# EAGLE schematic BMS_Master (EAGLE 7.2.0)

## Sheet 1 of 5
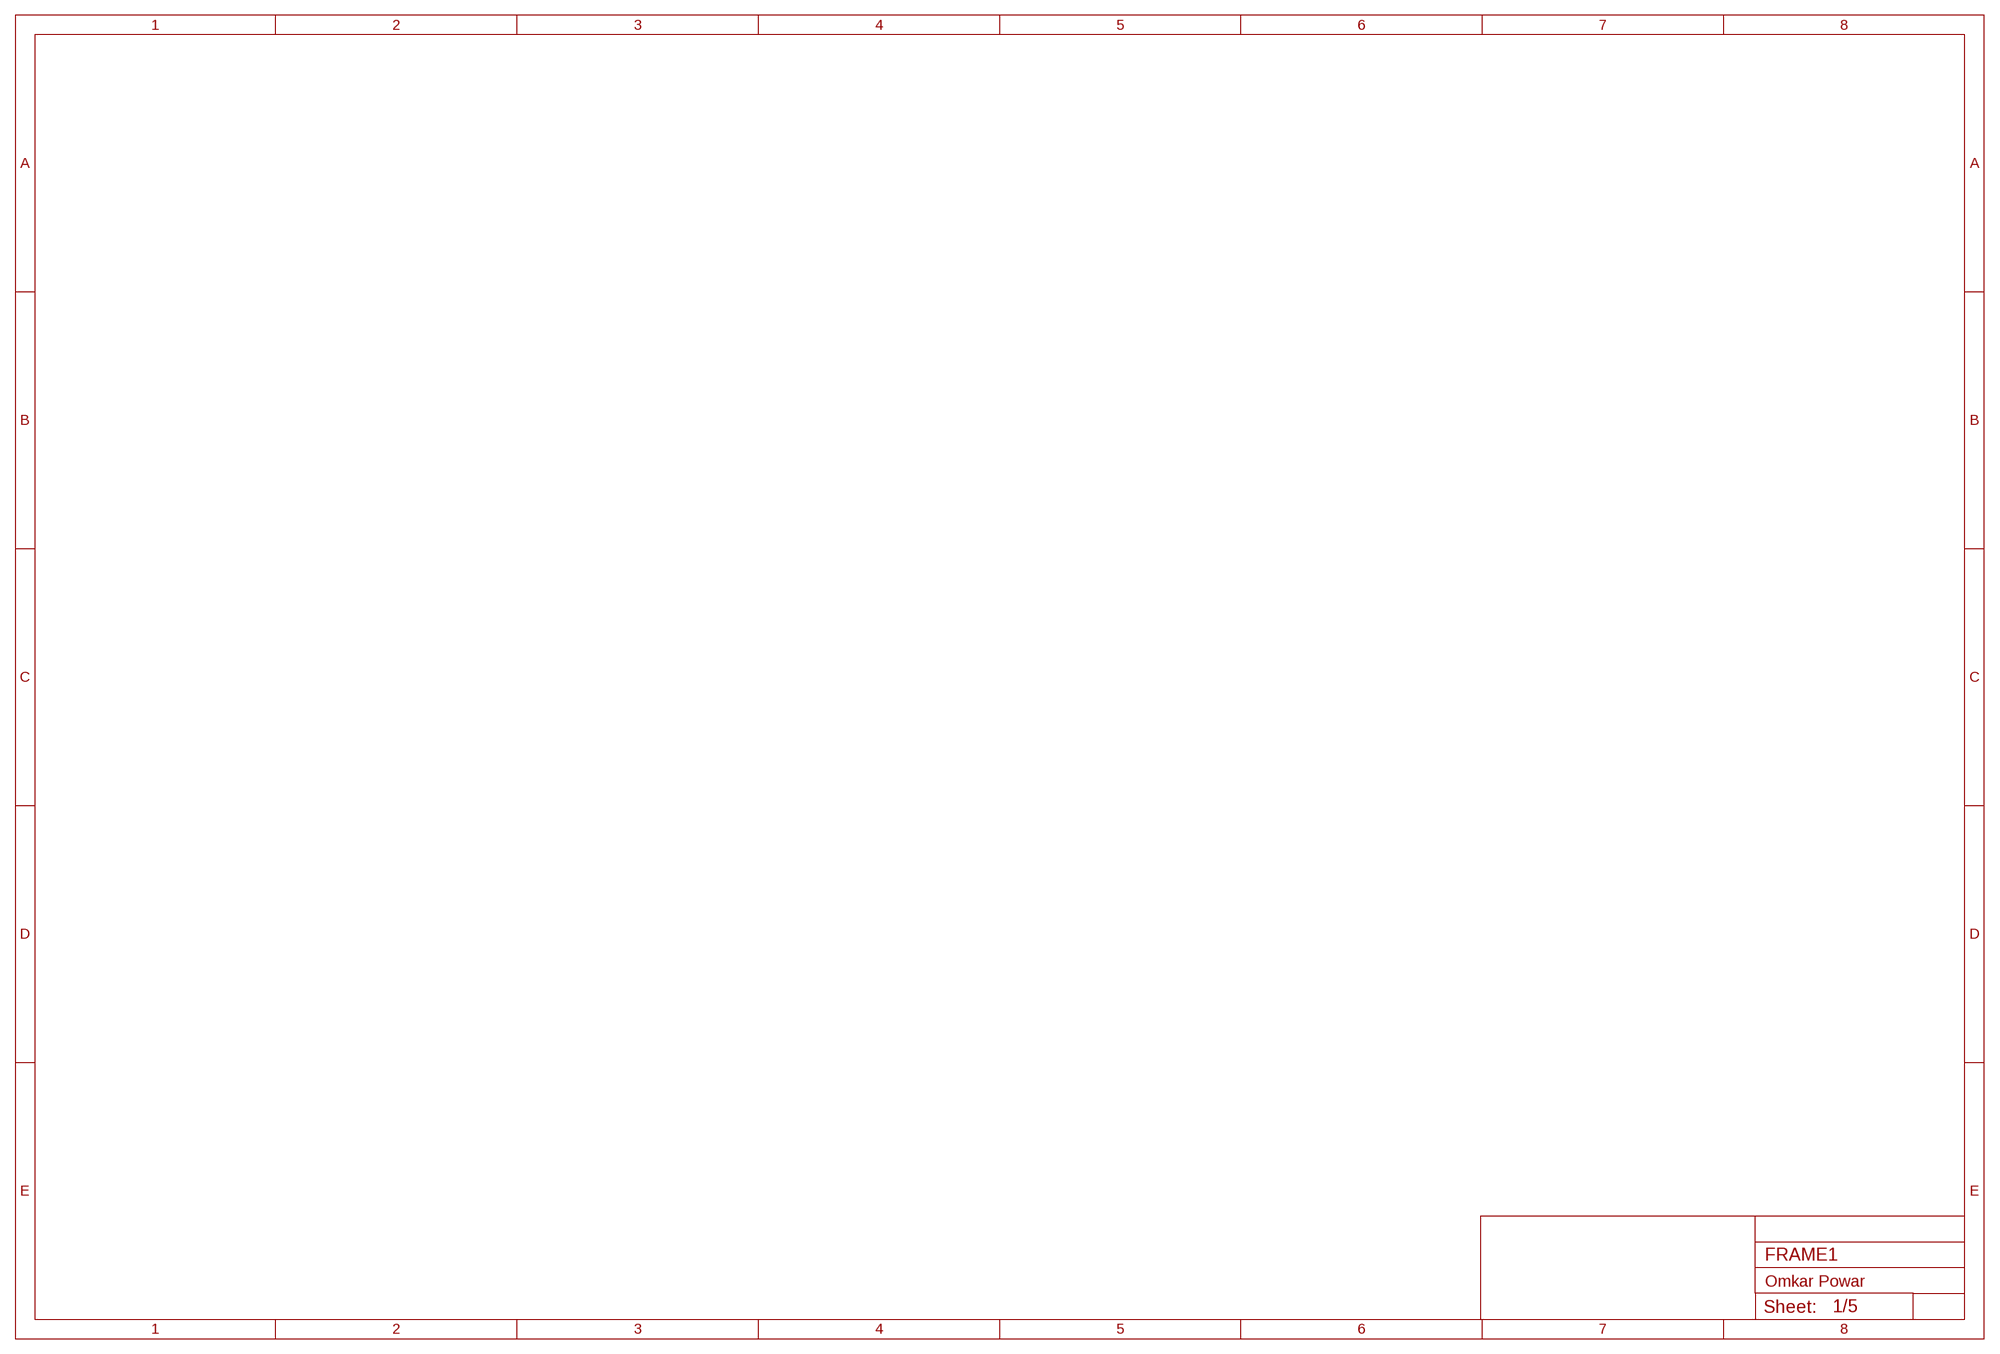
[diagram p0: schematic, sheet 1]

## Sheet 2 of 5
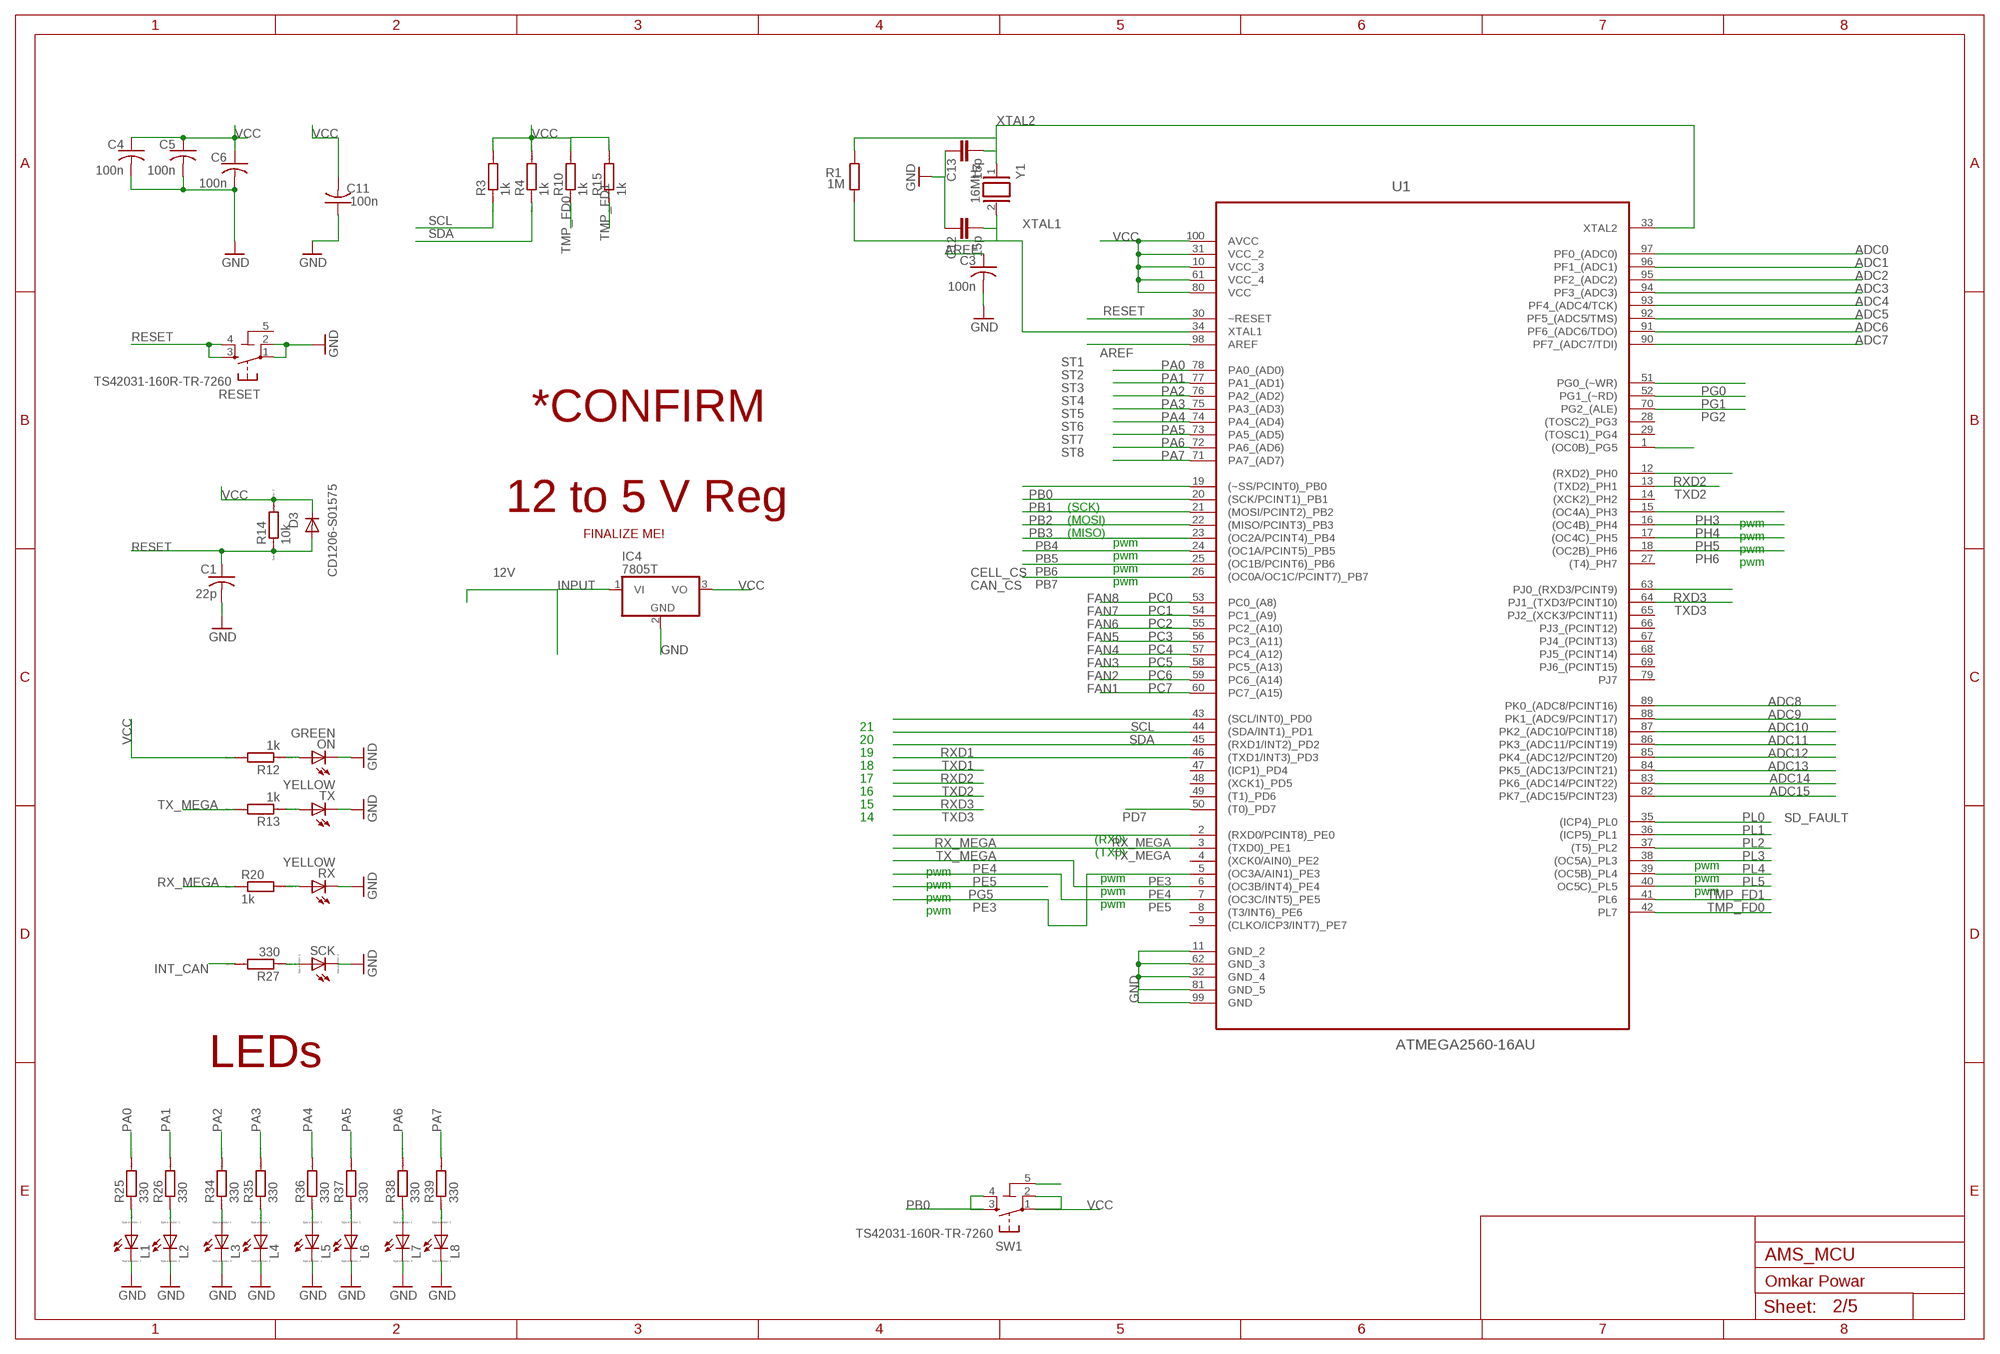
[diagram p1: schematic, sheet 2]

### Parts
C1  22p  C-USC1206  [C1206]
C3  100n  C-USC1206  [C1206]
C4  100n  C-USC1206  [C1206]
C5  100n  C-USC1206  [C1206]
C6  100n  C-USC1206  [C1206]
C11  100n  C-USC1206  [C1206]
C12  15p  C-EU0603-RND  [C0603-ROUND]
C13  15p  C-EU0603-RND  [C0603-ROUND]
D3  CD1206-S01575  DIODE-MINIMELF  [MINIMELF]
IC4  7805T  [TO220H]
L1  LED_E  [LED_1206]
L2  LED_E  [LED_1206]
L3  LED_E  [LED_1206]
L4  LED_E  [LED_1206]
L5  LED_E  [LED_1206]
L6  LED_E  [LED_1206]
L7  LED_E  [LED_1206]
L8  LED_E  [LED_1206]
ON  GREEN  LEDCHIP-LED0805  [CHIP-LED0805]
R1  1M  R-EU_R1206W  [R1206W]
R3  1k  RR1206  [R1206]
R4  1k  RR1206  [R1206]
R10  1k  RR1206  [R1206]
R12  1k  RR0603  [R0603]
R13  1k  RR0603  [R0603]
R14  10k  RR1206  [R1206]
R15  1k  RR1206  [R1206]
R20  1k  RR0603  [R0603]
R25  330  RR0603  [R0603]
R26  330  RR0603  [R0603]
R27  330  RR0603  [R0603]
R34  330  RR0603  [R0603]
R35  330  RR0603  [R0603]
R36  330  RR0603  [R0603]
R37  330  RR0603  [R0603]
R38  330  RR0603  [R0603]
R39  330  RR0603  [R0603]
RESET  TS42031-160R-TR-7260  TS42  [TS42]
RX  YELLOW  LEDCHIP-LED0805  [CHIP-LED0805]
SCK  LED_E  [LED_1206]
SW1  TS42031-160R-TR-7260  TS42  [TS42]
TX  YELLOW  LEDCHIP-LED0805  [CHIP-LED0805]
U1  ATMEGA2560-16AU  [QFP50P1600X1600X120-100N]
Y1  16MHz  XTAL/S  [QS]

### Nets
ADC0: U1.97(PF0_(ADC0))
ADC1: U1.96(PF1_(ADC1))
ADC2: U1.95(PF2_(ADC2))
ADC3: U1.94(PF3_(ADC3))
ADC4: U1.93(PF4_(ADC4/TCK))
ADC5: U1.92(PF5_(ADC5/TMS))
ADC6: U1.91(PF6_(ADC6/TDO))
ADC7: U1.90(PF7_(ADC7/TDI))
ADC8: U1.89(PK0_(ADC8/PCINT16))
ADC9: U1.88(PK1_(ADC9/PCINT17))
ADC10: U1.87(PK2_(ADC10/PCINT18))
ADC11: U1.86(PK3_(ADC11/PCINT19))
ADC12: U1.85(PK4_(ADC12/PCINT20))
ADC13: U1.84(PK5_(ADC13/PCINT21))
ADC14: U1.83(PK6_(ADC14/PCINT22))
ADC15: U1.82(PK7_(ADC15/PCINT23))
AREF: C3.1 U1.98(AREF)
GND [gnd]: C1.2 C3.2 C4.2 C5.2 C6.2 C11.1 C12.1 C13.1 IC4.2(GND) L1.C L2.C L3.C L4.C L5.C L6.C L7.C L8.C ON.C RESET.1 RESET.2 RX.C SCK.C SW1.5(5-GND) TX.C U1.11(GND_2) U1.32(GND_4) U1.62(GND_3) U1.81(GND_5) U1.99(GND) ; also sheet 3,4,5
INPUT: IC4.1(VI) ; also sheet 4
INT_CAN: R27.2 ; also sheet 3
N$1: R20.2 RX.A
N$2: R13.1 TX.A
N$3: ON.A R12.1
N$4: R27.1 SCK.A
N$25: L1.A R25.1
N$26: L2.A R26.1
N$32: L3.A R34.1
N$33: L4.A R35.1
N$34: L5.A R36.1
N$35: L6.A R37.1
N$36: L7.A R38.1
N$38: L8.A R39.1
PA0: R25.2 U1.78(PA0_(AD0))
PA1: R26.2 U1.77(PA1_(AD1))
PA2: R34.2 U1.76(PA2_(AD2))
PA3: R35.2 U1.75(PA3_(AD3))
PA4: R36.2 U1.74(PA4_(AD4))
PA5: R37.2 U1.73(PA5_(AD5))
PA6: R38.2 U1.72(PA6_(AD6))
PA7: R39.2 U1.71(PA7_(AD7))
PB0: SW1.3 SW1.4 U1.19((~SS/PCINT0)_PB0)
PB1: U1.20((SCK/PCINT1)_PB1) ; also sheet 3,4
PB2: U1.21((MOSI/PCINT2)_PB2) ; also sheet 3,4
PB3: U1.22((MISO/PCINT3)_PB3) ; also sheet 3,4
PB4: U1.23((OC2A/PCINT4)_PB4) ; also sheet 4
PB5: U1.24((OC1A/PCINT5)_PB5) ; also sheet 4
PB6: U1.25((OC1B/PCINT6)_PB6) ; also sheet 3
PB7: U1.26((OC0A/OC1C/PCINT7)_PB7) ; also sheet 3
PC0: U1.53(PC0_(A8))
PC1: U1.54(PC1_(A9))
PC2: U1.55(PC2_(A10))
PC3: U1.56(PC3_(A11))
PC4: U1.57(PC4_(A12))
PC5: U1.58(PC5_(A13))
PC6: U1.59(PC6_(A14))
PC7: U1.60(PC7_(A15))
PE3: U1.5((OC3A/AIN1)_PE3)
PE4: U1.6((OC3B/INT4)_PE4)
PE5: U1.7((OC3C/INT5)_PE5)
PG0: U1.51(PG0_(~WR))
PG1: U1.52(PG1_(~RD))
PG2: U1.70(PG2_(ALE))
PG5: U1.1((OC0B)_PG5)
PH3: U1.15((OC4A)_PH3)
PH4: U1.16((OC4B)_PH4)
PH5: U1.17((OC4C)_PH5)
PH6: U1.18((OC2B)_PH6)
PL0: U1.35((ICP4)_PL0) ; also sheet 4
PL1: U1.36((ICP5)_PL1) ; also sheet 4
PL2: U1.37((T5)_PL2)
PL3: U1.38((OC5A)_PL3)
PL4: U1.39((OC5B)_PL4)
PL5: U1.40(OC5C)_PL5)
RESET: C1.1 D3.A R14.1 RESET.3 RESET.4 U1.30(~RESET) ; also sheet 3,4
RX_MEGA: R20.1 U1.2((RXD0/PCINT8)_PE0) ; also sheet 3,4
RXD1: U1.45((RXD1/INT2)_PD2)
RXD2: U1.12((RXD2)_PH0)
RXD3: U1.63(PJ0_(RXD3/PCINT9))
SCL: R3.1 U1.43((SCL/INT0)_PD0) ; also sheet 4
SDA: R4.1 U1.44((SDA/INT1)_PD1) ; also sheet 4
TMP_FD0: R10.1 U1.42(PL7) ; also sheet 3
TMP_FD1: R15.1 U1.41(PL6) ; also sheet 3
TX_MEGA: R13.2 U1.3((TXD0)_PE1) ; also sheet 3,4
TXD1: U1.46((TXD1/INT3)_PD3)
TXD2: U1.13((TXD2)_PH1)
TXD3: U1.64(PJ1_(TXD3/PCINT10))
VCC: C4.1 C5.1 C6.1 C11.2 D3.C IC4.3(VO) R3.2 R4.2 R10.2 R12.2 R14.2 R15.2 SW1.1 SW1.2 U1.10(VCC_3) U1.31(VCC_2) U1.61(VCC_4) U1.80(VCC) U1.100(AVCC) ; also sheet 3,4,5
XTAL1: C12.2 R1.1 U1.34(XTAL1) Y1.2
XTAL2: C13.2 R1.2 U1.33(XTAL2) Y1.1
Unconnected: U1.4((XCK0/AIN0)_PE2) U1.8((T3/INT6)_PE6) U1.9((CLKO/ICP3/INT7)_PE7) U1.14((XCK2)_PH2) U1.27((T4)_PH7) U1.28((TOSC2)_PG3) U1.29((TOSC1)_PG4) U1.47((ICP1)_PD4) U1.48((XCK1)_PD5) U1.49((T1)_PD6) U1.50((T0)_PD7) U1.65(PJ2_(XCK3/PCINT11)) U1.66(PJ3_(PCINT12)) U1.67(PJ4_(PCINT13)) U1.68(PJ5_(PCINT14)) U1.69(PJ6_(PCINT15)) U1.79(PJ7)

### Notes on the sheet
- ST1
- ST2
- ST3
- ST4
- ST5
- *CONFIRM | ST6
- ST7
- ST8
- (SCK)
- 12 to 5 V Reg | (MOSI)
- pwm
- (MISO) | pwm
- FINALIZE ME! | pwm
- pwm
- pwm
- pwm
- pwm
- 12V | CELL_CS | pwm
- CAN_CS
- FAN8
- FAN7
- FAN6
- FAN5
- FAN4
- FAN3
- FAN2
- FAN1
- 21
- 20
- 19
- 18
- 17
- 16
- 15
- 14
- SD_FAULT
- (RX0)
- (TX0)
- pwm
- pwm
- pwm | pwm
- pwm
- pwm | pwm
- pwm
- pwm
- pwm
- LEDs

## Sheet 3 of 5
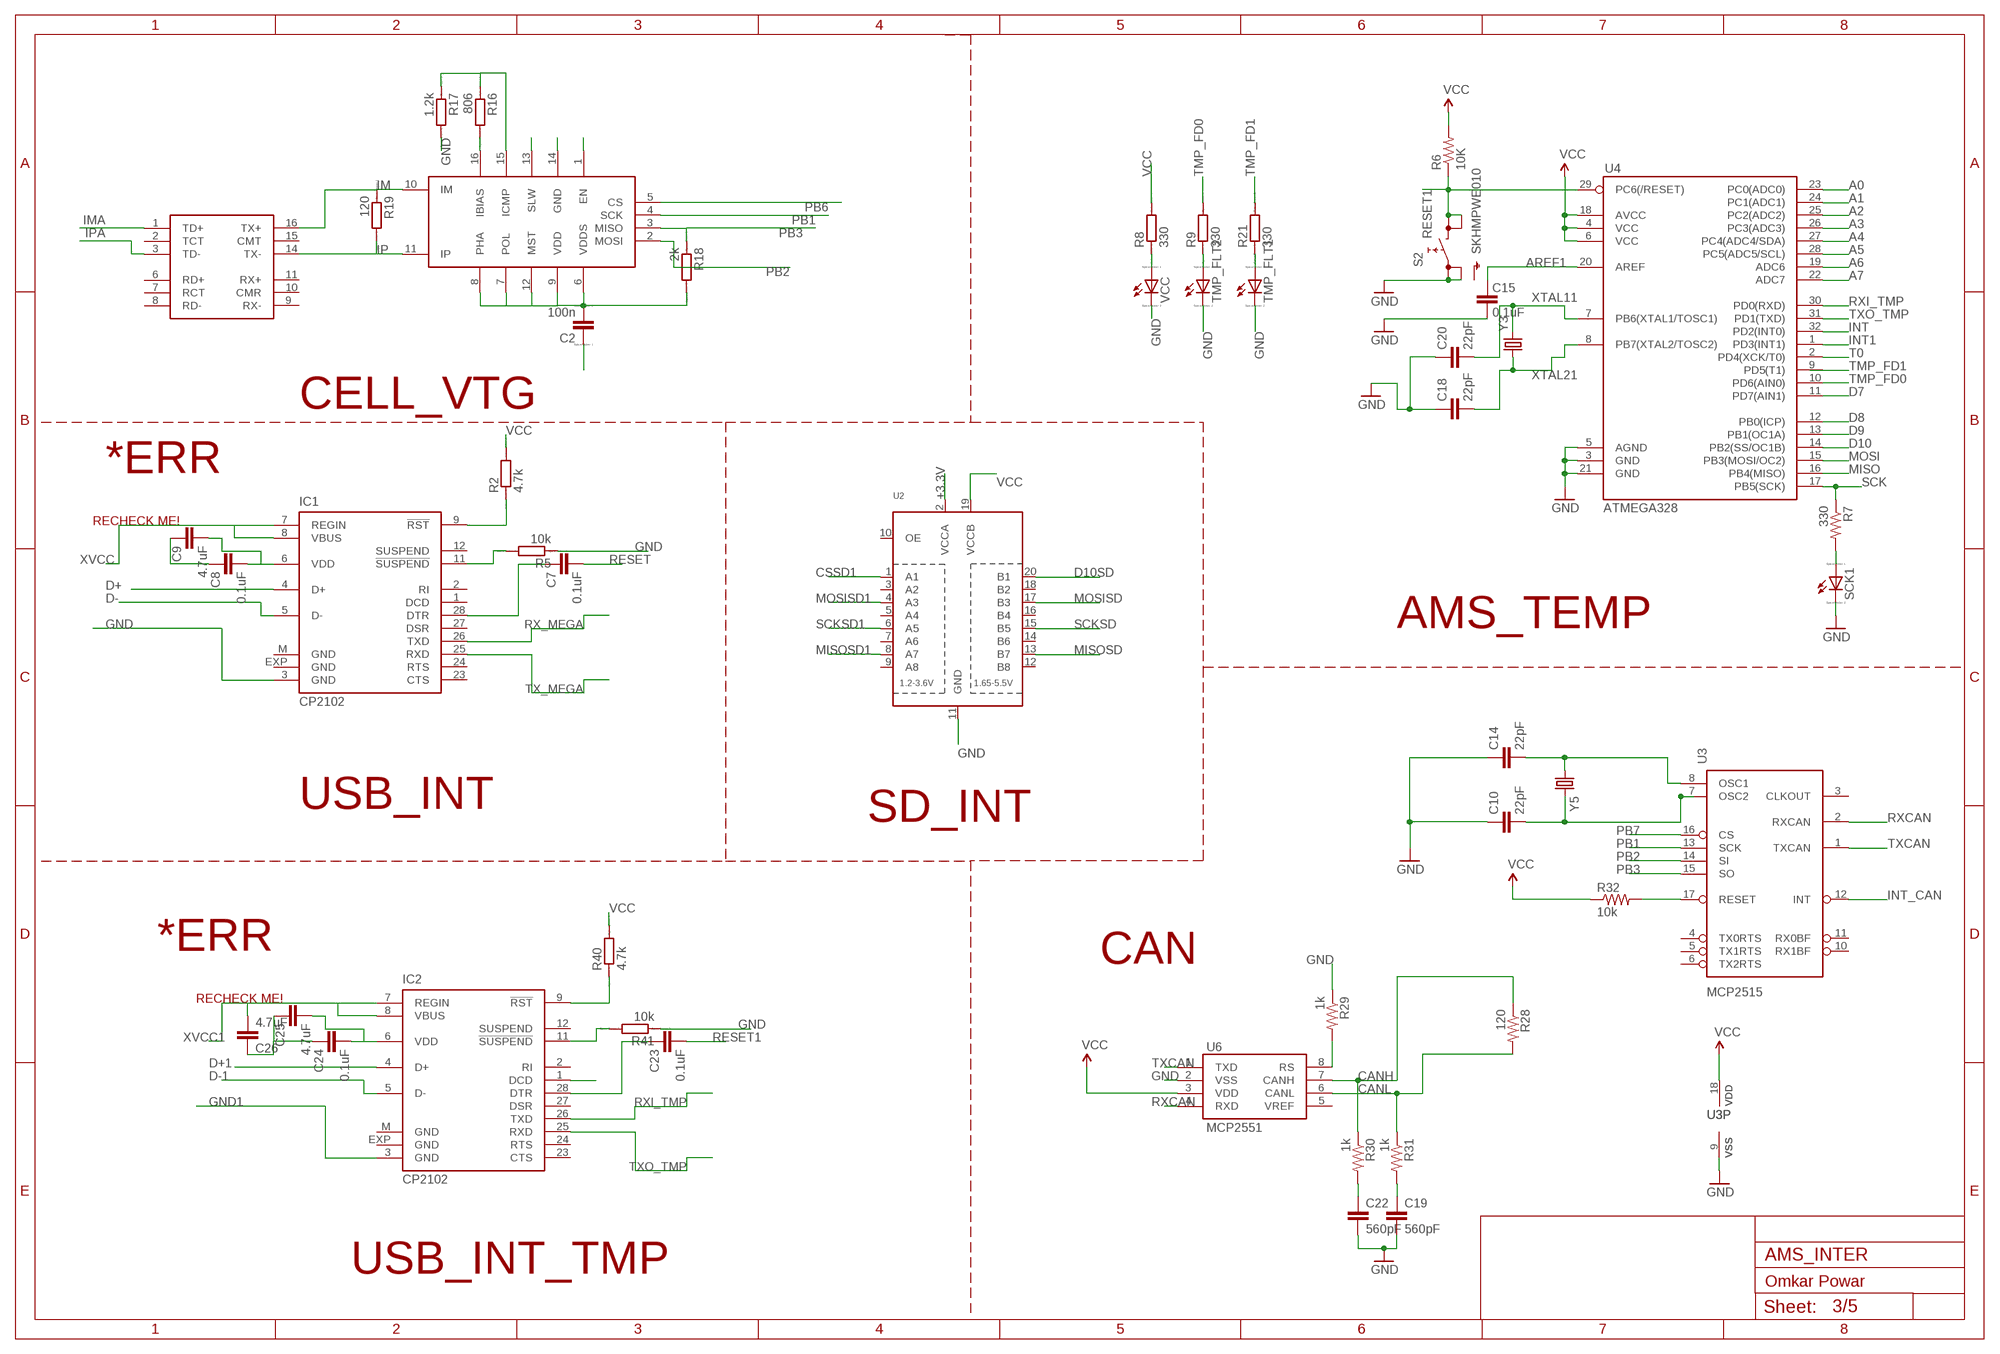
[diagram p2: schematic, sheet 3]

### Parts
C2  100n  CC1206  [C1206]
C7  0.1uF  C-EUC1206  [C1206]
C8  0.1uF  C-EUC1206  [C1206]
C9  4.7uF  C-EUC1206  [C1206]
C10  22pF  CAP1206  [1206]
C14  22pF  CAP1206  [1206]
C15  0.1uF  CAP1206  [1206]
C18  22pF  CAP1206  [1206]
C19  560pF  CAP1206  [1206]
C20  22pF  CAP1206  [1206]
C22  560pF  CAP1206  [1206]
C23  0.1uF  C-EUC1206  [C1206]
C24  0.1uF  C-EUC1206  [C1206]
C25  4.7uF  C-EUC1206  [C1206]
C26  4.7uF  C-EUC1206  [C1206]
IC1  CP2102  [MLP28]
IC2  CP2102  [MLP28]
R2  4.7k  RR1206  [R1206]
R5  10k  RR1206  [R1206]
R6  10K  RESISTOR1206  [1206]
R7  330  RESISTOR0603-RES  [0603-RES]
R8  330  RR0603  [R0603]
R9  330  RR0603  [R0603]
R16  806  RR1206  [R1206]
R17  1.2k  RR1206  [R1206]
R18  2k  RR1206  [R1206]
R19  120  RR1206  [R1206]
R21  330  RR0603  [R0603]
R28  120  RESISTOR1206  [1206]
R29  1k  RESISTOR1206  [1206]
R30  1k  RESISTOR1206  [1206]
R31  1k  RESISTOR1206  [1206]
R32  10k  RESISTOR1206  [1206]
R40  4.7k  RR1206  [R1206]
R41  10k  RR1206  [R1206]
S2  SKHMPWE010  [SKHMPXE010]
SCK1  LED_E  [LED_1206]
TMP_FLT1  LED_E  [LED_1206]
TMP_FLT2  LED_E  [LED_1206]
U2  TXB0108PWR  [TSSOP20]
U3  MCP2515  MCP2510SO  [SO-18W]
U4  ATMEGA328  ATMEGA168  [TQFP32-08]
U6  MCP2551  [SO08]
U$3  LTC6820  [LTC6820]
U$4  HX1188N  [HX1188]
VCC  LED_E  [LED_1206]
Y3  CRYSTALHC49US  [HC49US]
Y5  CRYSTALHC49US  [HC49US]

### Nets
+3.3V: U2.2(VCCA) ; also sheet 4,5
A0: U4.23(PC0(ADC0))
A1: U4.24(PC1(ADC1))
A2: U4.25(PC2(ADC2))
A3: U4.26(PC3(ADC3))
A4: U4.27(PC4(ADC4/SDA))
A5: U4.28(PC5(ADC5/SCL))
A6: U4.19(ADC6)
A7: U4.22(ADC7)
AREF1: C15.2 U4.20(AREF)
CANH: R28.1 R30.1 U6.7(CANH) ; also sheet 4
CANL: R28.2 R31.1 U6.6(CANL) ; also sheet 4
CSSD1: U2.1(A1) ; also sheet 4
D7: U4.11(PD7(AIN1)) ; also sheet 4
D8: U4.12(PB0(ICP)) ; also sheet 4
D9: U4.13(PB1(OC1A)) ; also sheet 4
D10: U4.14(PB2(SS/OC1B)) ; also sheet 4
D10SD: U2.20(B1) ; also sheet 5
D+: IC1.4(D+) ; also sheet 4
D+1: IC2.4(D+) ; also sheet 4
D-: IC1.5(D-) ; also sheet 4
D-1: IC2.5(D-) ; also sheet 4
GND [gnd]: C2.1 C8.1 C9.1 C10.1 C14.1 C15.1 C18.1 C19.2 C20.1 C22.2 C24.1 C25.1 C26.1 IC1.3(GND) R5.1 R17.2 R29.1 R41.1 S2.1(1.1) S2.2(1.2) SCK1.C TMP_FLT1.C TMP_FLT2.C U2.11(GND) U3.9(VSS) U4.3(GND) U4.5(AGND) U4.21(GND) U6.2(VSS) U$3.1(EN) U$3.13(SLW) U$3.14(GND) VCC.C ; also sheet 2,4,5
GND1 [gnd]: IC2.3(GND)
IM: R19.1 U$3.10(IM) U$4.16(TX+)
IMA: U$4.1(TD+) ; also sheet 4
INT: U4.32(PD2(INT0))
INT1: U4.1(PD3(INT1))
INT_CAN: U3.12(INT) ; also sheet 2
IP: R19.2 U$3.11(IP) U$4.14(TX-)
IPA: U$4.3(TD-) ; also sheet 4
MISO: U4.16(PB4(MISO)) ; also sheet 4
MISOSD: U2.13(B7) ; also sheet 4,5
MISOSD1: U2.8(A7) ; also sheet 4
MOSI: U4.15(PB3(MOSI/OC2)) ; also sheet 4
MOSISD: U2.17(B3) ; also sheet 4,5
MOSISD1: U2.4(A3) ; also sheet 4
N$5: C14.2 U3.8(OSC1) Y5.1
N$6: C10.2 U3.7(OSC2) Y5.2
N$7: R16.2 U$3.16(IBIAS)
N$8: R16.1 R17.1 U$3.15(ICMP)
N$9: R29.2 U6.8(RS)
N$10: IC2.1(DCD)
N$13: C22.1 R30.2
N$16: C19.1 R31.2
N$18: C7.1 IC1.28(DTR)
N$19: IC1.11(!SUSPEND) R5.2
N$20: C8.2 C9.2 IC1.6(VDD)
N$21: IC1.9(!RST) R2.1
N$23: R32.2 U3.17(RESET)
N$24: R7.2 SCK1.A
N$27: R8.1 VCC.A
N$28: R9.1 TMP_FLT2.A
N$29: R21.1 TMP_FLT1.A
N$37: C23.1 IC2.28(DTR)
N$40: C24.2 C25.2 IC2.6(VDD)
N$41: IC2.9(!RST) R40.1
N$42: IC2.11(!SUSPEND) R41.2
PB1: U3.13(SCK) U$3.4(SCK) ; also sheet 2,4
PB2: U3.14(SI) U$3.2(MOSI) ; also sheet 2,4
PB3: R18.1 U3.15(SO) U$3.3(MISO) ; also sheet 2,4
PB6: U$3.5(CS) ; also sheet 2
PB7: U3.16(CS) ; also sheet 2
RESET: C7.2 ; also sheet 2,4
RESET1: C23.2 R6.1 S2.3(2.1) S2.4(2.2) U4.29(PC6(/RESET)) ; also sheet 4
RX_MEGA: IC1.26(TXD) ; also sheet 2,4
RXCAN: U3.2(RXCAN) U6.4(RXD)
RXI_TMP: IC2.26(TXD) U4.30(PD0(RXD)) ; also sheet 4
SCK: R7.1 U4.17(PB5(SCK)) ; also sheet 4
SCKSD: U2.15(B5) ; also sheet 4,5
SCKSD1: U2.6(A5) ; also sheet 4
T0: U4.2(PD4(XCK/T0)) ; also sheet 5
TMP_FD0: R9.2 U4.10(PD6(AIN0)) ; also sheet 2
TMP_FD1: R21.2 U4.9(PD5(T1)) ; also sheet 2
TX_MEGA: IC1.25(RXD) ; also sheet 2,4
TXCAN: U3.1(TXCAN) U6.1(TXD)
TXO_TMP: IC2.25(RXD) U4.31(PD1(TXD)) ; also sheet 4
VCC: C2.2 R2.2 R6.2 R8.2 R18.2 R32.1 R40.2 U2.19(VCCB) U3.18(VDD) U4.4(VCC) U4.6(VCC) U4.18(AVCC) U6.3(VDD) U$3.6(VDDS) U$3.7(POL) U$3.8(PHA) U$3.9(VDD) U$3.12(MST) ; also sheet 2,4,5
XTAL11: C20.2 U4.7(PB6(XTAL1/TOSC1)) Y3.2
XTAL21: C18.2 U4.8(PB7(XTAL2/TOSC2)) Y3.1
XVCC [power usb]: IC1.7(REGIN) IC1.8(VBUS) ; also sheet 4
XVCC1 [power usb]: C26.2 IC2.7(REGIN) IC2.8(VBUS) ; also sheet 4
Unconnected: IC1.1(DCD) IC1.2(RI) IC1.12(SUSPEND) IC1.23(CTS) IC1.24(RTS) IC1.27(DSR) IC2.2(RI) IC2.12(SUSPEND) IC2.23(CTS) IC2.24(RTS) IC2.27(DSR) S2.5(SH) U2.3(A2) U2.5(A4) U2.7(A6) U2.9(A8) U2.10(OE) U2.12(B8) U2.14(B6) U2.16(B4) U2.18(B2) U3.3(CLKOUT) U3.4(TX0RTS) U3.5(TX1RTS) U3.6(TX2RTS) U3.10(RX1BF) U3.11(RX0BF) U6.5(VREF) U$4.2(TCT) U$4.6(RD+) U$4.7(RCT) U$4.8(RD-) U$4.9(RX-) U$4.10(CMR) U$4.11(RX+) U$4.15(CMT)

### Notes on the sheet
- CELL_VTG
- *ERR
- RECHECK ME!
- AMS_TEMP
- USB_INT | SD_INT
- *ERR | CAN
- RECHECK ME!
- USB_INT_TMP

## Sheet 4 of 5
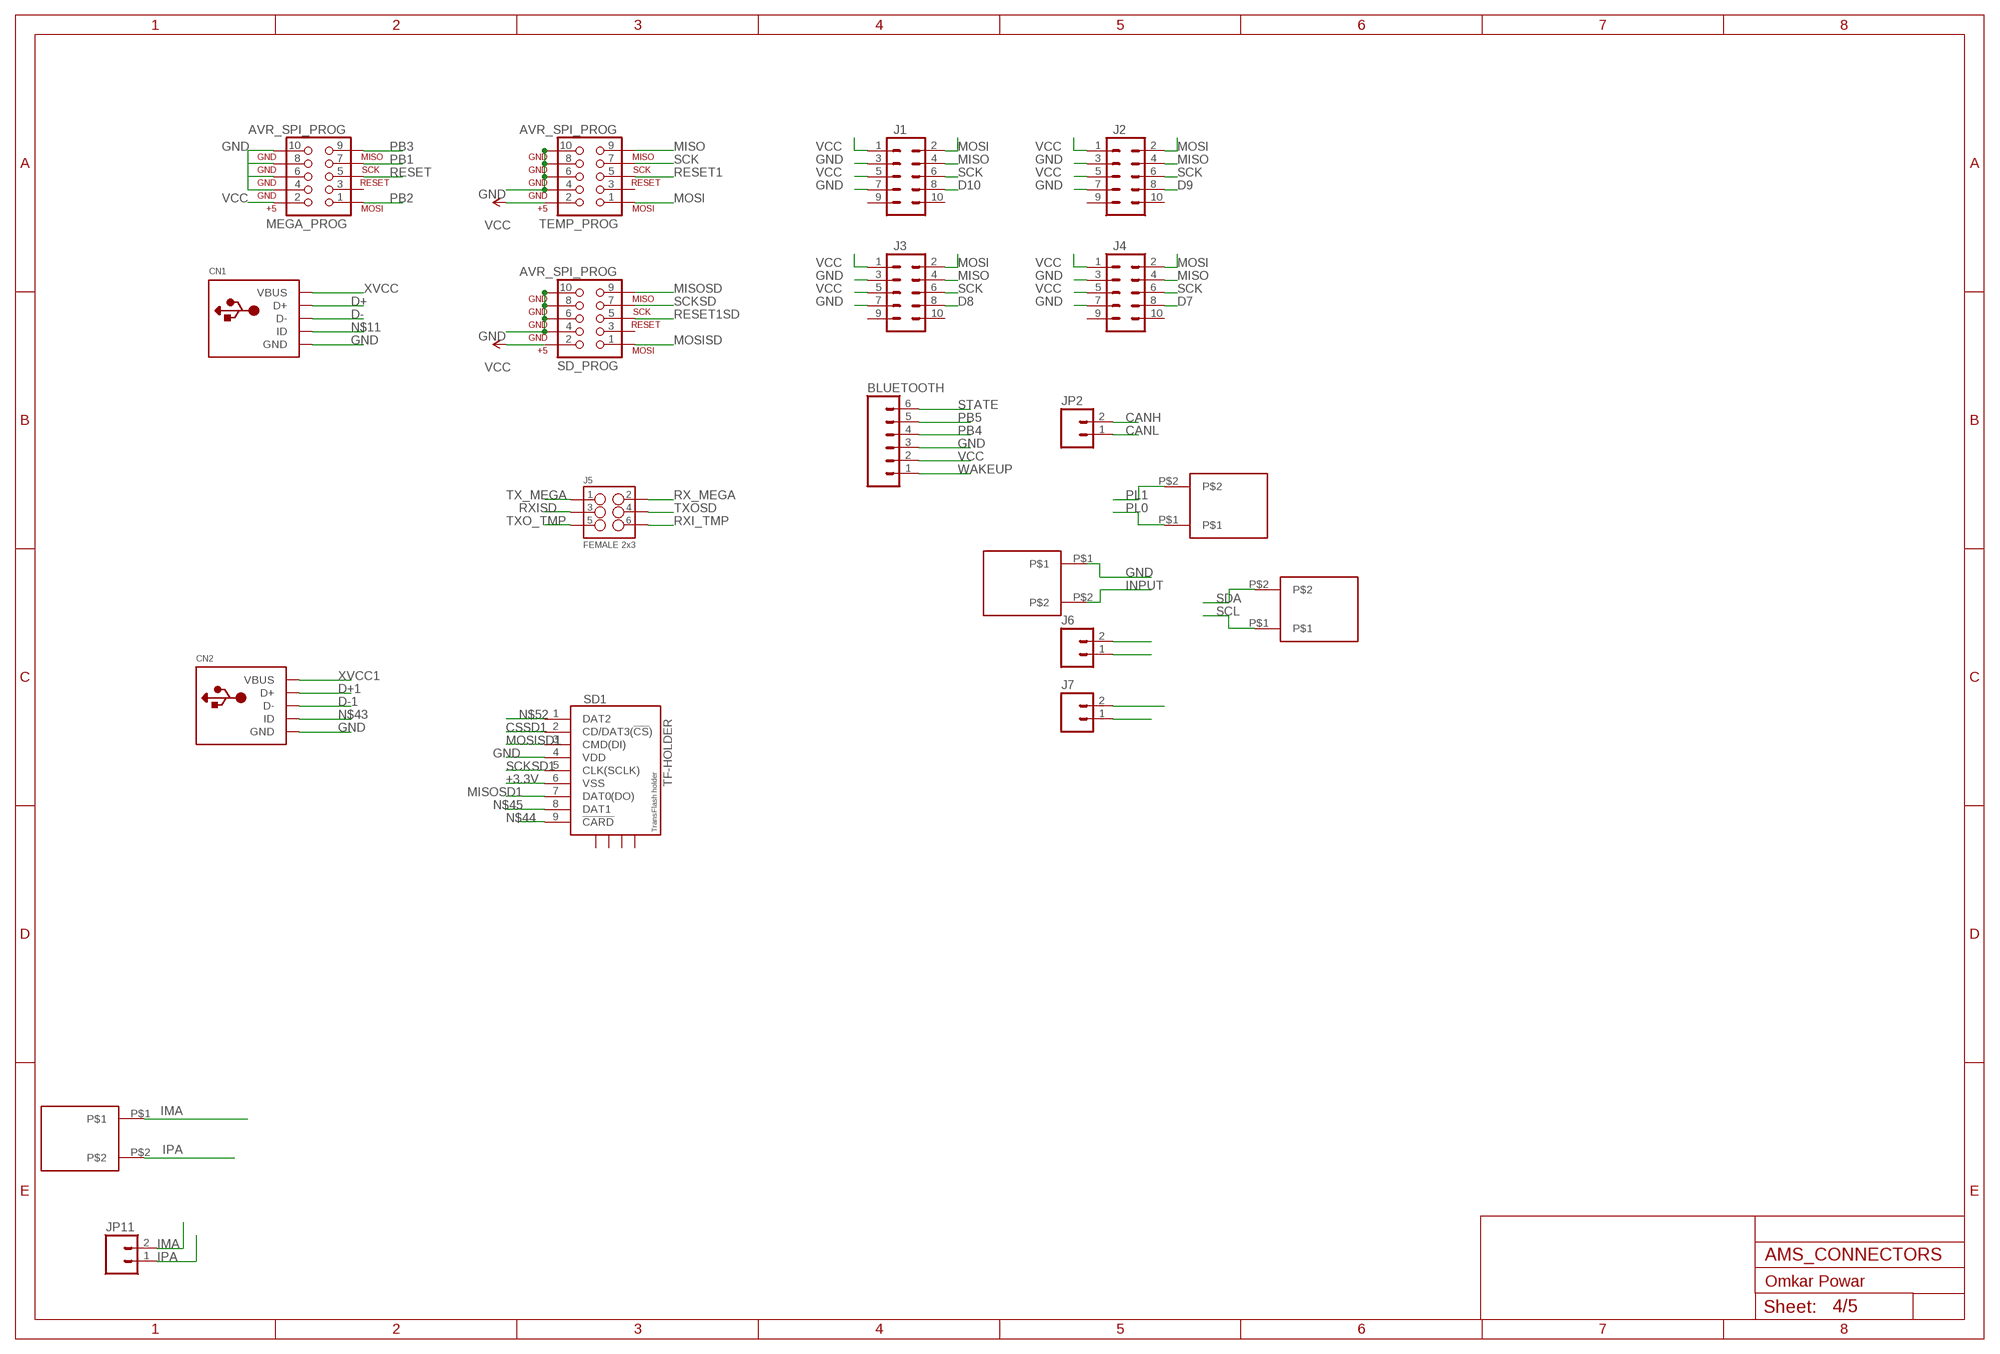
[diagram p3: schematic, sheet 4]

### Parts
BLUETOOTH  M06SILK_FEMALE_PTH  [1X06]
CN1  USBMINIB  [USB-MINIB]
CN2  USBMINIB  [USB-MINIB]
J1  M05X2PTH  [AVR_ICSP]
J2  M05X2PTH  [AVR_ICSP]
J3  M05X2PTH  [AVR_ICSP]
J4  M05X2PTH  [AVR_ICSP]
J5  FEMALE 2x3  M03X2FEMALE  [2X3]
J6  M02PTH  [1X02]
J7  M02PTH  [1X02]
JP2  M02JST-PTH-2  [JST-2-PTH]
JP11  M02PTH  [1X02]
MEGA_PROG  AVR_SPI_PROG  [AVR_ICSP]
SD1  TF-HOLDER  [TF-PULL]
SD_PROG  AVR_SPI_PROG  [AVR_ICSP]
TEMP_PROG  AVR_SPI_PROG  [AVR_ICSP]
U$1  MOLEX_2_PIN  [MOLEX_2PIN]
U$5  MOLEX_2_PIN  [MOLEX_2PIN]
U$6  MOLEX_2_PIN  [MOLEX_2PIN]
U$7  MOLEX_2_PIN  [MOLEX_2PIN]

### Nets
+3.3V: SD1.6(VSS) ; also sheet 3,5
CANH: JP2.2 ; also sheet 3
CANL: JP2.1 ; also sheet 3
CSSD1: SD1.2(CD/DAT3(!CS!)) ; also sheet 3
D7: J4.8 ; also sheet 3
D8: J3.8 ; also sheet 3
D9: J2.8 ; also sheet 3
D10: J1.8 ; also sheet 3
D+: CN1.D+ ; also sheet 3
D+1: CN2.D+ ; also sheet 3
D-: CN1.D- ; also sheet 3
D-1: CN2.D- ; also sheet 3
GND [gnd]: BLUETOOTH.3 CN1.GND CN2.GND J1.3 J1.7 J2.3 J2.7 J3.3 J3.7 J4.3 J4.7 MEGA_PROG.4 MEGA_PROG.6 MEGA_PROG.8 MEGA_PROG.10 SD1.4(VDD) SD_PROG.4 SD_PROG.6 SD_PROG.8 SD_PROG.10 TEMP_PROG.4 TEMP_PROG.6 TEMP_PROG.8 TEMP_PROG.10 U$6.P$1 ; also sheet 2,3,5
IMA: JP11.2 U$5.P$1 ; also sheet 3
INPUT: U$6.P$2 ; also sheet 2
IPA: JP11.1 U$5.P$2 ; also sheet 3
MISO: J1.4 J2.4 J3.4 J4.4 TEMP_PROG.9 ; also sheet 3
MISOSD: SD_PROG.9 ; also sheet 3,5
MISOSD1: SD1.7(DAT0(DO)) ; also sheet 3
MOSI: J1.2 J2.2 J3.2 J4.2 TEMP_PROG.1 ; also sheet 3
MOSISD: SD_PROG.1 ; also sheet 3,5
MOSISD1: SD1.3(CMD(DI)) ; also sheet 3
N$11: CN1.ID
N$43: CN2.ID
N$44: SD1.9(!CARD)
N$45: SD1.8(DAT1)
N$52: SD1.1(DAT2)
PB1: MEGA_PROG.7 ; also sheet 2,3
PB2: MEGA_PROG.1 ; also sheet 2,3
PB3: MEGA_PROG.9 ; also sheet 2,3
PB4: BLUETOOTH.4 ; also sheet 2
PB5: BLUETOOTH.5 ; also sheet 2
PL0: U$7.P$1 ; also sheet 2
PL1: U$7.P$2 ; also sheet 2
RESET: MEGA_PROG.5 ; also sheet 2,3
RESET1: TEMP_PROG.5 ; also sheet 3
RESET1SD: SD_PROG.5 ; also sheet 5
RX_MEGA: J5.2 ; also sheet 2,3
RXI_TMP: J5.6 ; also sheet 3
RXISD: J5.3 ; also sheet 5
SCK: J1.6 J2.6 J3.6 J4.6 TEMP_PROG.7 ; also sheet 3
SCKSD: SD_PROG.7 ; also sheet 3,5
SCKSD1: SD1.5(CLK(SCLK)) ; also sheet 3
SCL: U$1.P$1 ; also sheet 2
SDA: U$1.P$2 ; also sheet 2
STATE: BLUETOOTH.6
TX_MEGA: J5.1 ; also sheet 2,3
TXO_TMP: J5.5 ; also sheet 3
TXOSD: J5.4 ; also sheet 5
VCC: BLUETOOTH.2 J1.1 J1.5 J2.1 J2.5 J3.1 J3.5 J4.1 J4.5 J6.1 J7.1 MEGA_PROG.2 SD_PROG.2 TEMP_PROG.2 ; also sheet 2,3,5
WAKEUP: BLUETOOTH.1
XVCC [power usb]: CN1.VBUS J6.2 ; also sheet 3
XVCC1 [power usb]: CN2.VBUS J7.2 ; also sheet 3
Unconnected: J1.9 J1.10 J2.9 J2.10 J3.9 J3.10 J4.9 J4.10 MEGA_PROG.3 SD1.S1 SD1.S2 SD1.S3 SD1.S4 SD_PROG.3 TEMP_PROG.3

## Sheet 5 of 5
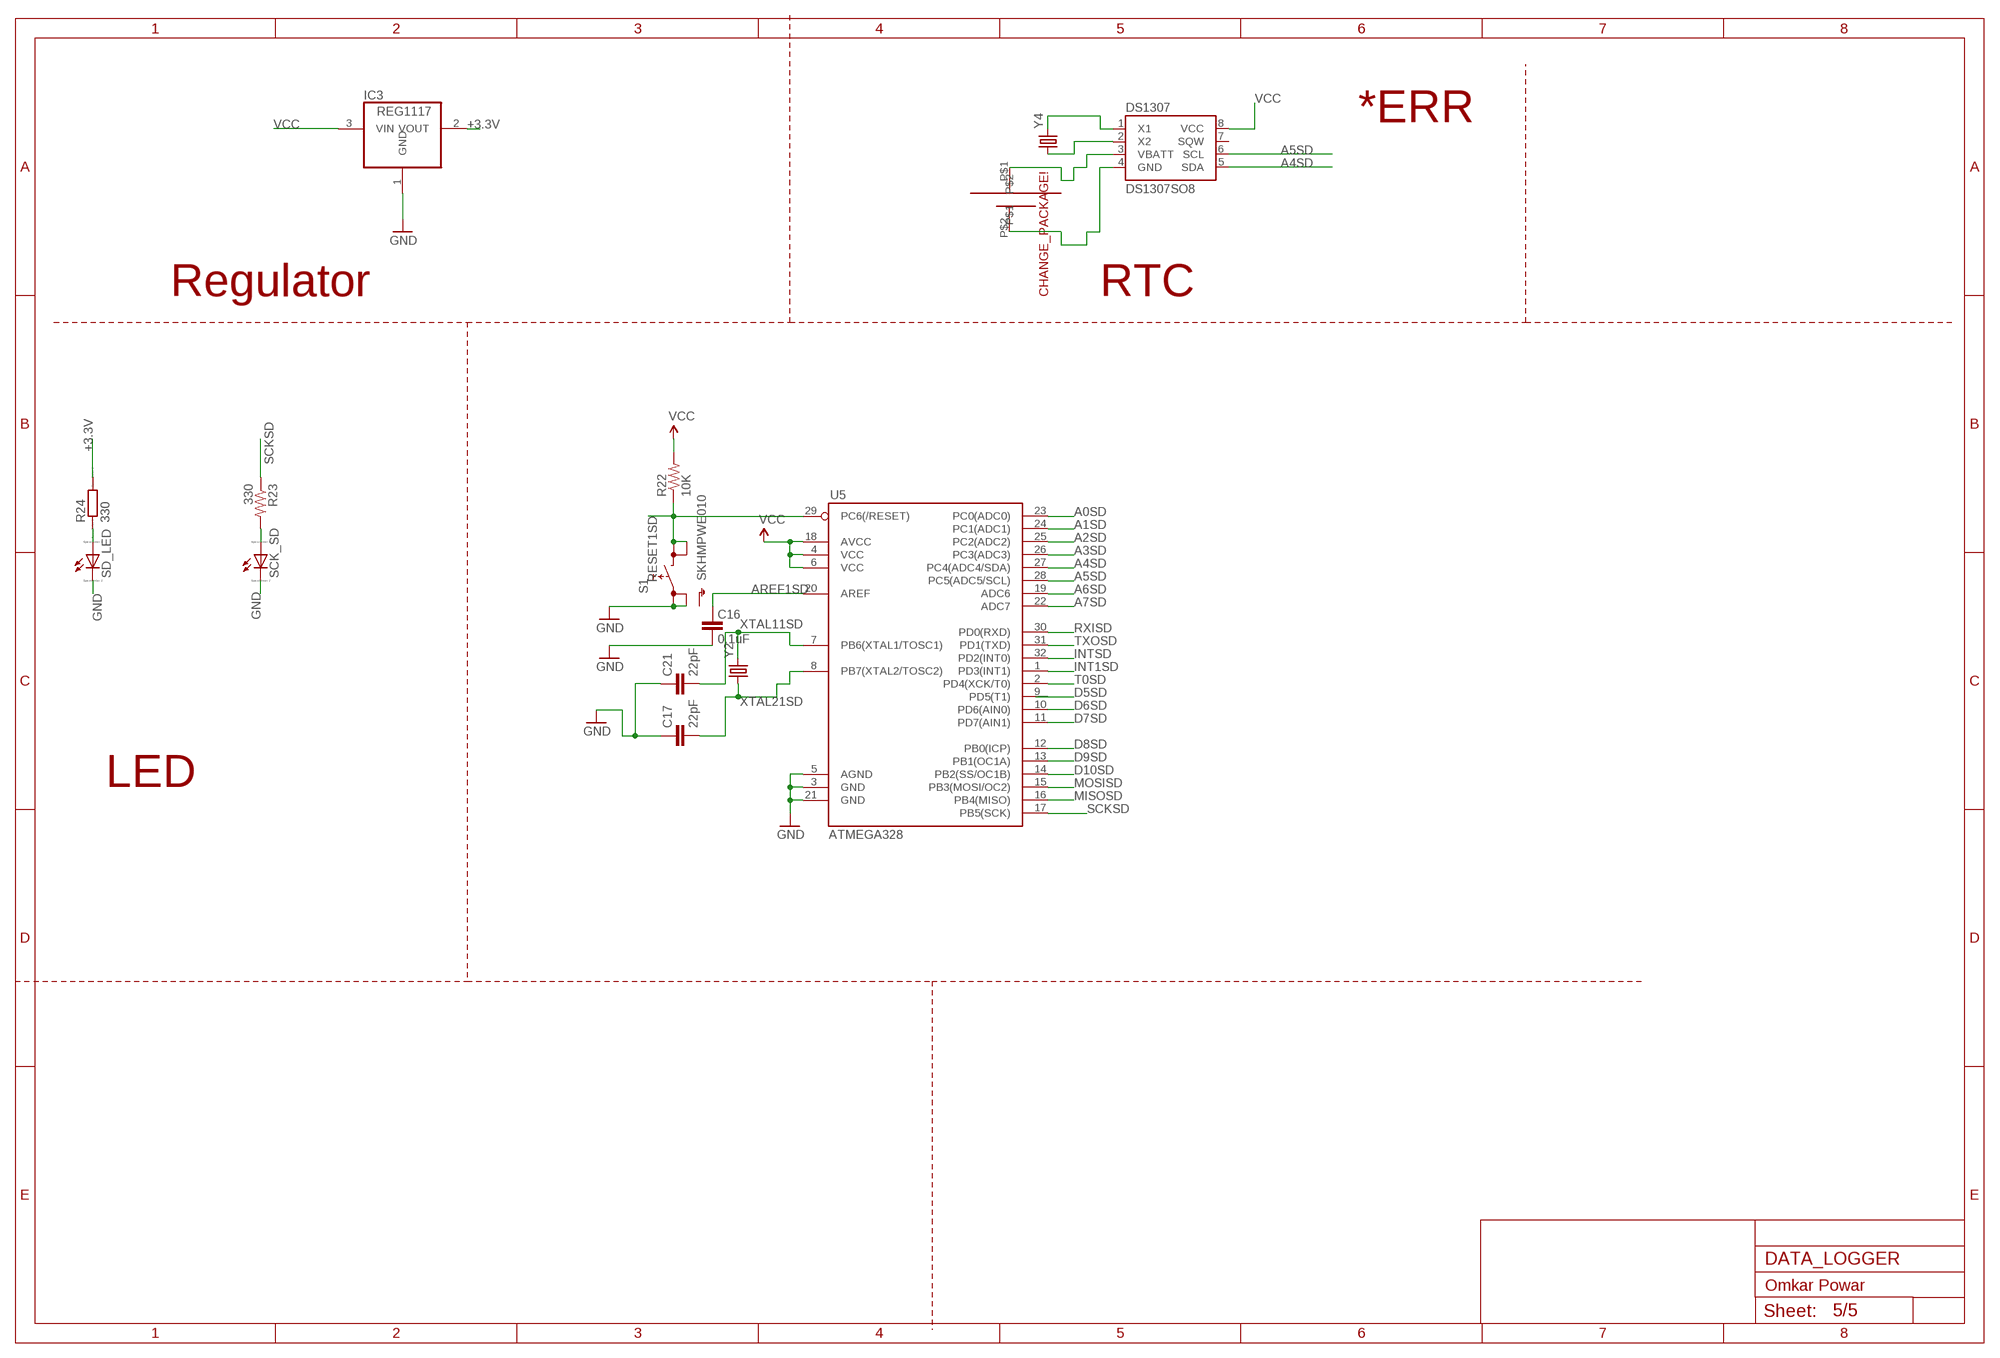
[diagram p4: schematic, sheet 5]

### Parts
C16  0.1uF  CAP1206  [1206]
C17  22pF  CAP1206  [1206]
C21  22pF  CAP1206  [1206]
CR2032  CR2032  [CR2032]
DS1307  DS1307SO8  [SO08]
IC3  REG1117  [SOT223]
R22  10K  RESISTOR1206  [1206]
R23  330  RESISTOR1206  [1206]
R24  330  RR1206  [R1206]
S1  SKHMPWE010  [SKHMPXE010]
SCK_SD  LED_E  [LED_1206]
SD_LED  LED_E  [LED_1206]
U5  ATMEGA328  ATMEGA168  [TQFP32-08]
Y2  CRYSTALHC49US  [HC49US]
Y4  CRYSTAL32-SMD  [CRYSTAL-32KHZ-SMD]

### Nets
+3.3V: IC3.2(VOUT) R24.2 ; also sheet 3,4
A0SD: U5.23(PC0(ADC0))
A1SD: U5.24(PC1(ADC1))
A2SD: U5.25(PC2(ADC2))
A3SD: U5.26(PC3(ADC3))
A4SD: DS1307.5(SDA) U5.27(PC4(ADC4/SDA))
A5SD: DS1307.6(SCL) U5.28(PC5(ADC5/SCL))
A6SD: U5.19(ADC6)
A7SD: U5.22(ADC7)
AREF1SD: C16.2 U5.20(AREF)
D5SD: U5.9(PD5(T1))
D6SD: U5.10(PD6(AIN0))
D7SD: U5.11(PD7(AIN1))
D8SD: U5.12(PB0(ICP))
D9SD: U5.13(PB1(OC1A))
D10SD: U5.14(PB2(SS/OC1B)) ; also sheet 3
GND [gnd]: C16.1 C17.1 C21.1 IC3.1(GND) S1.1(1.1) S1.2(1.2) SCK_SD.C SD_LED.C U5.3(GND) U5.5(AGND) U5.21(GND) ; also sheet 2,3,4
INT1SD: U5.1(PD3(INT1))
INTSD: U5.32(PD2(INT0))
MISOSD: U5.16(PB4(MISO)) ; also sheet 3,4
MOSISD: U5.15(PB3(MOSI/OC2)) ; also sheet 3,4
N$12: DS1307.1(X1) Y4.X2
N$14: DS1307.2(X2) Y4.X1
N$15: CR2032.P$2 DS1307.4(GND)
N$30: R23.2 SCK_SD.A
N$31: R24.1 SD_LED.A
N$39: CR2032.P$1 DS1307.3(VBATT)
RESET1SD: R22.1 S1.3(2.1) S1.4(2.2) U5.29(PC6(/RESET)) ; also sheet 4
RXISD: U5.30(PD0(RXD)) ; also sheet 4
SCKSD: R23.1 U5.17(PB5(SCK)) ; also sheet 3,4
T0SD: U5.2(PD4(XCK/T0))
TXOSD: U5.31(PD1(TXD)) ; also sheet 4
VCC: DS1307.8(VCC) IC3.3(VIN) R22.2 U5.4(VCC) U5.6(VCC) U5.18(AVCC) ; also sheet 2,3,4
XTAL11SD: C21.2 U5.7(PB6(XTAL1/TOSC1)) Y2.2
XTAL21SD: C17.2 U5.8(PB7(XTAL2/TOSC2)) Y2.1
Unconnected: DS1307.7(SQW) S1.5(SH)

### Notes on the sheet
- *ERR
- Regulator | CHANGE_PACKAGE! | RTC
- LED

## Power pins joined to a net without a drawn wire
5-GND: RESET.5(5-GND)
GND: IC1.EXP(GND) IC1.M(GND) IC2.EXP(GND) IC2.M(GND)

## Library data of the parts
BLUETOOTH = SparkFun-Connectors:M06: Header 6 Standard 6-pin 0.1" header. Use with straight break away headers (SKU : PRT-00116), right angle break away headers (PRT-00553), swiss pins (PRT-00743), machine pins (PRT-00117), and female headers (PRT-00115). Molex polarized connector foot print use with SKU : PRT-08094 with associated crimp pins and housings. NOTES ON THE VARIANTS LOCK and LOCK_LONGPADS... This footprint was designed to help hold the alignment of a through-hole component (i.e. 6-pin header) while soldering it into place. You may notice that each hole has been shifted either up or down by 0.005 of an inch from it's more standard position (which is a perfectly straight line). This slight alteration caused the pins (the squares in the middle) to touch the edges of the holes. Because they are alternating, it causes a "brace" to hold the component in place. 0.005 has proven to be the perfect amount of "off-center" position when using our standard breakaway headers. Although looks a little odd when you look at the bare footprint, once you have a header in there, the alteration is very hard to notice. Also,if you push a header all the way into place, it is covered up entirely on the bottom side. This idea of altering the position of holes to aid alignment will be further integrated into the Sparkfun Library for other footprints. It can help hold any component with 3 or more connection pins.; PROD_ID: CONN-08437
C1 C3-C6 C11 = adafruit:C-US: CAPACITOR, American symbol
C2 = eagle-ltspice:C: CAPACITOR, European symbol; SPICEMODEL: NONE; SPICEPREFIX: C
C7-C9 C12 C13 C23-C26 = SmartPrj:C-EU: CAPACITOR, European symbol
C10 C14 C17-C22 = SparkFun-Capacitors:CAP: Capacitor Standard 0603 ceramic capacitor, and 0.1" leaded capacitor.
C15 C16 = SparkFun:CAP: Capacitor Standard 0603 ceramic capacitor, and 0.1" leaded capacitor.
CN1 CN2 = adafruit:USB: USB Connectors USBMINIB - Surface Mount Female Mini-B USB Connector 4UConnector: 06564 By microbuilder.eu Thru-hole RA Female Mini-B USB Connector 4UConnector: 18732 By ladyada.net
CR2032 = CR2032:CR2032
D3 = diode:DIODE-: DIODE
DS1307 = SparkFun-FreqCtrl:DS1307: I2C real-time clock with battery backup.
IC1 IC2 = silabs:CP210*: Single-Chip USB to UART Bridge Source: www.silabs.com .. CP2101.pdf / cp2102.pdf; MF: FARNELL; MPN: CP2102-GM; OC_FARNELL: 9282130; OC_NEWARK: 30K5635
IC3 = burr-brown:REG1117: 800mA and 1A Low Dropout (LDO) Positive Regulator 1.8V, 2.5V, 2.85V, 3.3V, 5V, and Adj; MPN: REG1117; OC_FARNELL: 1097566; OC_NEWARK: 14P6981
IC4 = adafruit:78*: Positive VOLTAGE REGULATOR Added bigger pads to the TO-92 package
J1-J4 = SparkFun-Connectors:M05X2: Header 5x2 Standard 10-pin dual row 0.1" header. Commonly used with AVR-ISP. Use with Spark Fun Electronics SKU: PRT-00778
J5 = SparkFun-Connectors:M03X2: 2x3 .1" header. Shrouded, with keying- CONN-10681 SMT- CONN-11415 Pogo pins- HW-11044; PROD_ID: CONN-11566
J6 J7 JP11 = SparkFun-Connectors:M02: Standard 2-pin 0.1" header. Use with - straight break away headers ( PRT-00116) - right angle break away headers (PRT-00553) - swiss pins (PRT-00743) - machine pins (PRT-00117) - female headers (PRT-00115) Molex polarized connector foot print use with: PRT-08233 with associated crimp pins and housings. 2.54_SCREWTERM for use with PRT-10571. 3.5mm Screw Terminal footprints for PRT-08084 5mm Screw Terminal footprints for use with PRT-08432
JP2 = SparkFun-Connectors:M02: Standard 2-pin 0.1" header. Use with - straight break away headers ( PRT-00116) - right angle break away headers (PRT-00553) - swiss pins (PRT-00743) - machine pins (PRT-00117) - female headers (PRT-00115) Molex polarized connector foot print use with: PRT-08233 with associated crimp pins and housings. 2.54_SCREWTERM for use with PRT-10571. 3.5mm Screw Terminal footprints for PRT-08084 5mm Screw Terminal footprints for use with PRT-08432; PROD_ID: CONN-09863; SKU: PRT-09914
L1-L8 SCK SCK1 SCK_SD SD_LED TMP_FLT1 TMP_FLT2 VCC = eagle-ltspice:LED_E: LED Source: http://www.osram.convergy.de Source: www.luxeon.com Source: www.kingbright.com; SPICEMODEL: NONE; SPICEPREFIX: D; SPICETYPE: diode
MEGA_PROG SD_PROG TEMP_PROG = SparkFun-Connectors:AVR_SPI_PROG: AVR 10-pin ICSP Header This is the standard AVR In Circuit Serial Programming header. Minimal, but includes pin one indicator. Works with standard Olimex programmers. Also look for the 6-pin reduced version. Spark Fun Electronics SKU: PRT-00778
ON RX TX = led:LED: LED OSRAM: - CHIPLED LG R971, LG N971, LY N971, LG Q971, LY Q971, LO R971, LY R971 LH N974, LH R974 LS Q976, LO Q976, LY Q976 LO Q996 - Hyper CHIPLED LW Q18S LB Q993, LB Q99A, LB R99A - SideLED LS A670, LO A670, LY A670, LG A670, LP A670 LB A673, LV A673, LT A673, LW A673 LH A674 LY A675 LS A676, LA A676, LO A676, LY A676, LW A676 LS A679, LY A679, LG A679 - Hyper Micro SIDELED® LS Y876, LA Y876, LO Y876, LY Y876 LT Y87S - SmartLED LW L88C, LW L88S LB L89C, LB L89S, LG L890 LS L89K, LO L89K, LY L89K LS L896, LA L896, LO L896, LY L896 - TOPLED LS T670, LO T670, LY T670, LG T670, LP T670 LSG T670, LSP T670, LSY T670, LOP T670, LYG T670 LG T671, LOG T671, LSG T671 LB T673, LV T673, LT T673, LW T673 LH T674 LS T676, LA T676, LO T676, LY T676, LB T676, LH T676, LSB T676, LW T676 LB T67C, LV T67C, LT T67C, LS T67K, LO T67K, LY T67K, LW E67C LS E67B, LA E67B, LO E67B, LY E67B, LB E67C, LV E67C, LT E67C LW T67C LS T679, LY T679, LG T679 LS T770, LO T770, LY T770, LG T770, LP T770 LB T773, LV T773, LT T773, LW T773 LH T774 LS E675, LA E675, LY E675, LS T675 LS T776, LA T776, LO T776, LY T776, LB T776 LHGB T686 LT T68C, LB T68C - Hyper Mini TOPLED® LB M676 - Mini TOPLED Santana® LG M470 LS M47K, LO M47K, LY M47K Source: http://www.osram.convergy.de LUXEON: - LUMILED® LXK2-PW12-R00, LXK2-PW12-S00, LXK2-PW14-U00, LXK2-PW14-V00 LXK2-PM12-R00, LXK2-PM12-S00, LXK2-PM14-U00 LXK2-PE12-Q00, LXK2-PE12-R00, LXK2-PE12-S00, LXK2-PE14-T00, LXK2-PE14-U00 LXK2-PB12-K00, LXK2-PB12-L00, LXK2-PB12-M00, LXK2-PB14-N00, LXK2-PB14-P00, LXK2-PB14-Q00 LXK2-PR12-L00, LXK2-PR12-M00, LXK2-PR14-Q00, LXK2-PR14-R00 LXK2-PD12-Q00, LXK2-PD12-R00, LXK2-PD12-S00 LXK2-PH12-R00, LXK2-PH12-S00 LXK2-PL12-P00, LXK2-PL12-Q00, LXK2-PL12-R00 Source: www.luxeon.com KINGBRIGHT: KA-3528ASYC Source: www.kingbright.com
R1 = SmartPrj:R-EU_: RESISTOR, European symbol
R2-R5 R8-R10 R12-R21 R24-R27 R34-R41 = eagle-ltspice:R: RESISTOR, European symbol; SPICEMODEL: NONE; SPICEPREFIX: R
R6 R7 R22 R23 = SparkFun:RESISTOR: Resistor Basic schematic elements and footprints for 0603, 1206, and PTH resistors.
R28-R31 = SparkFun-Passives:RESISTOR: Resistor Basic schematic elements and footprints for 0603, 1206, and PTH resistors.
R32 = SparkFun-Resistors:RESISTOR: Resistor Basic schematic elements and footprints for 0603, 1206, and PTH resistors.
RESET SW1 = SmartPrj:TS42: TS42 Dongnan Electronics Tact switch VDC 12V - 50mA
S1 S2 = switch:SKHMP*E010: 6.2 X 6.5mm TACT Switch (SMD) Source: http://www3.alps.co.jp/WebObjects/catalog.woa/PDF/E/Switch/Tact/SKHM/SKHM.PDF
SD1 = sd-mmc:TF-HOLDER: TF / Micro SD socket is PUSH-PUSH type, the card can be pushed into and auto locked and pushed out by simply press the card. Surface Mounting type.
U1 = Atmel_By_element14_Batch_1-00:ATMEGA2560-16AU: Microcontroller; DESCRIPTION: Microcontroller; MPN: ATMEGA2560-16AU; OC_FARNELL: 1288330; OC_NEWARK: 23M5051; PACKAGE: LQFP-100; SUPPLIER: ATMEL
U2 = adafruit:TXB0108PWR: 8-Bit Bi-Directional Level Shifter 1.2V-3.6V (VCCA) to 1.65V-5.5V (VCCB) bi-directional level shifter with auto direction sensing. Max data rate - VCCA 1.8V: 20Mbps (50ns), VCCA 3.3V: 100Mbps (10ns) Digikey: 296-21527-1-ND
U3 = SparkFun-DigitalIC:MCP2510: CAN controller with SPI interface to any MCU. Original design by Microchip.; PROD_ID: IC-09906
U4 U5 = SparkFun:ATMEGA168
U6 = SparkFun-DigitalIC:MCP2551: CAN transceiver; PROD_ID: IC-09907
U$1 U$5-U$7 = Molex_NanoFit:MOLEX_2_PIN
U$3 = LTC6820:LTC6820
U$4 = HX1188NL:HX1188N
Y1 = SmartPrj:XTAL/S: CRYSTAL
Y2 Y3 Y5 = SparkFun-FreqCtrl:CRYSTAL: Various standard crystals. Proven footprints.
Y4 = SparkFun-FreqCtrl:CRYSTAL: Various standard crystals. Proven footprints.; PROD_ID: XTAL-07894

## Net classes
1 vcc: width 0.254 mm
2 gnd: width 0.305 mm, drill 0.406 mm, clearance 0.203 mm
3 power usb: width 0.508 mm, drill 0.406 mm, clearance 0.203 mm